# Altium schematic sheet Index.SchDoc
size A; DocumentNumber: 1; SheetNumber: 1; SheetTotal: 16
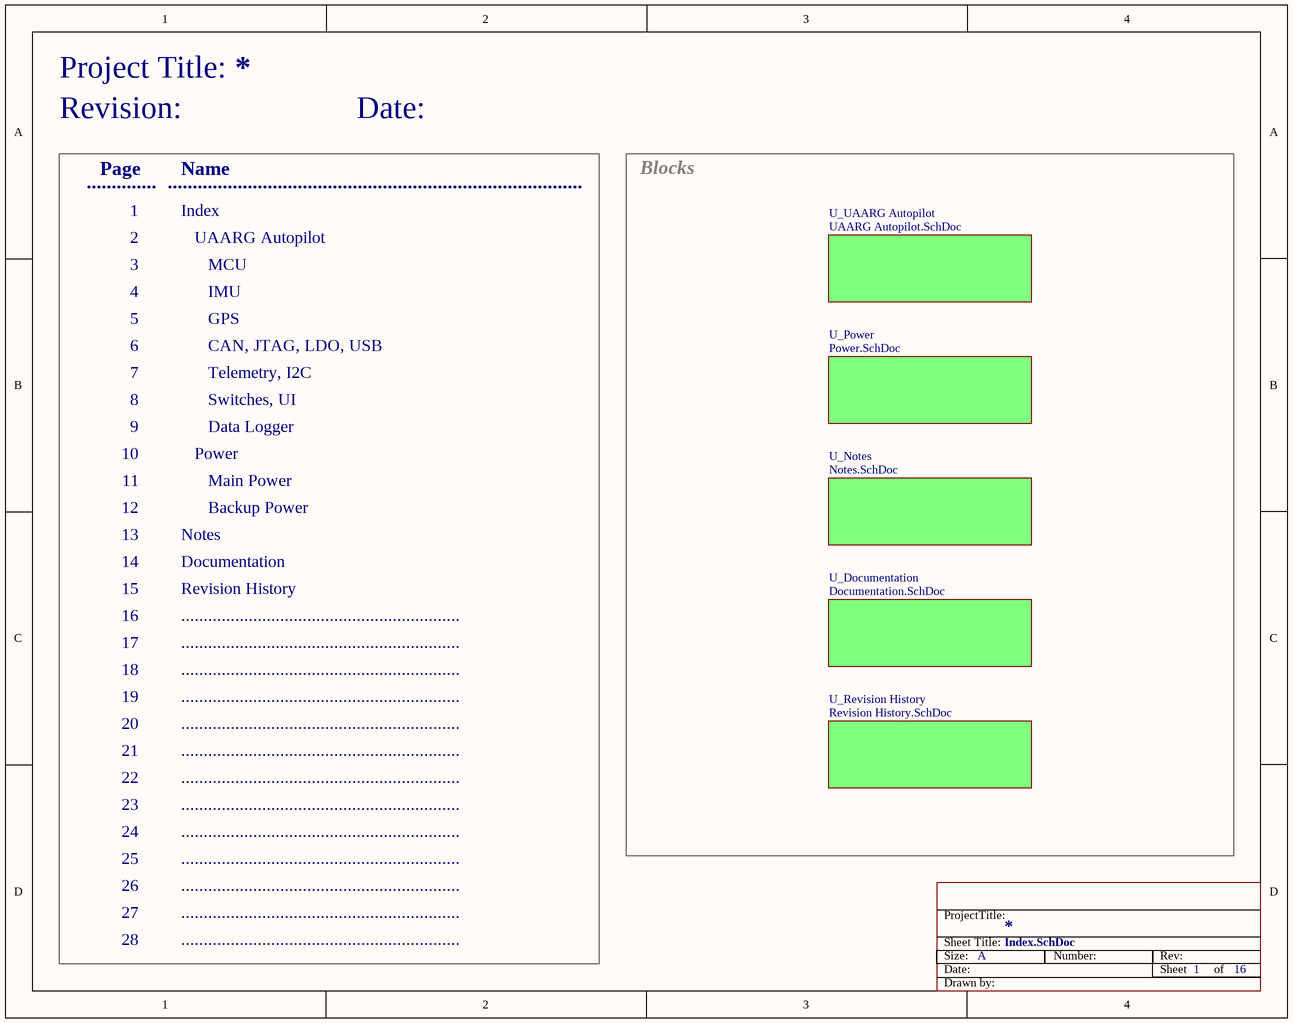
[diagram p0: Index.SchDoc]

## Sub-sheets
U_Documentation = Documentation.SchDoc: no entries
U_Notes = Notes.SchDoc: no entries
U_Power = Power.SchDoc: no entries
U_Revision History = Revision History.SchDoc: no entries
U_UAARG Autopilot = UAARG Autopilot.SchDoc: no entries

## Notes on the sheet
- Project Title:
- Revision:
- Date:
- Blocks
- ..............
- Page
- 1
- ...................................................................................
- Name
- Index
- 2
- 3
- 4
- UAARG Autopilot
- MCU
- IMU
- 5
- 6
- CAN, JTAG, LDO, USB
- GPS
- 7
- 8
- 9
- Data Logger
- Telemetry, I2C
- Switches, UI
- 11
- 10
- Power
- Main Power
- 14
- 13
- 12
- Notes
- Documentation
- Backup Power
- 16
- 15
- ..............................................................
- Revision History
- 18
- 17
- 19
- 21
- 20
- 23
- 22
- 24
- 25
- 26
- 27
- 28
- Sheet Title:
- ProjectTitle:
- Size:
- A
- Number:
- Rev:
- Sheet         of
- Drawn by: